# Altium schematic sheet LMV324AILQ对射-20260911.SchDoc
size 400 x 400 mm
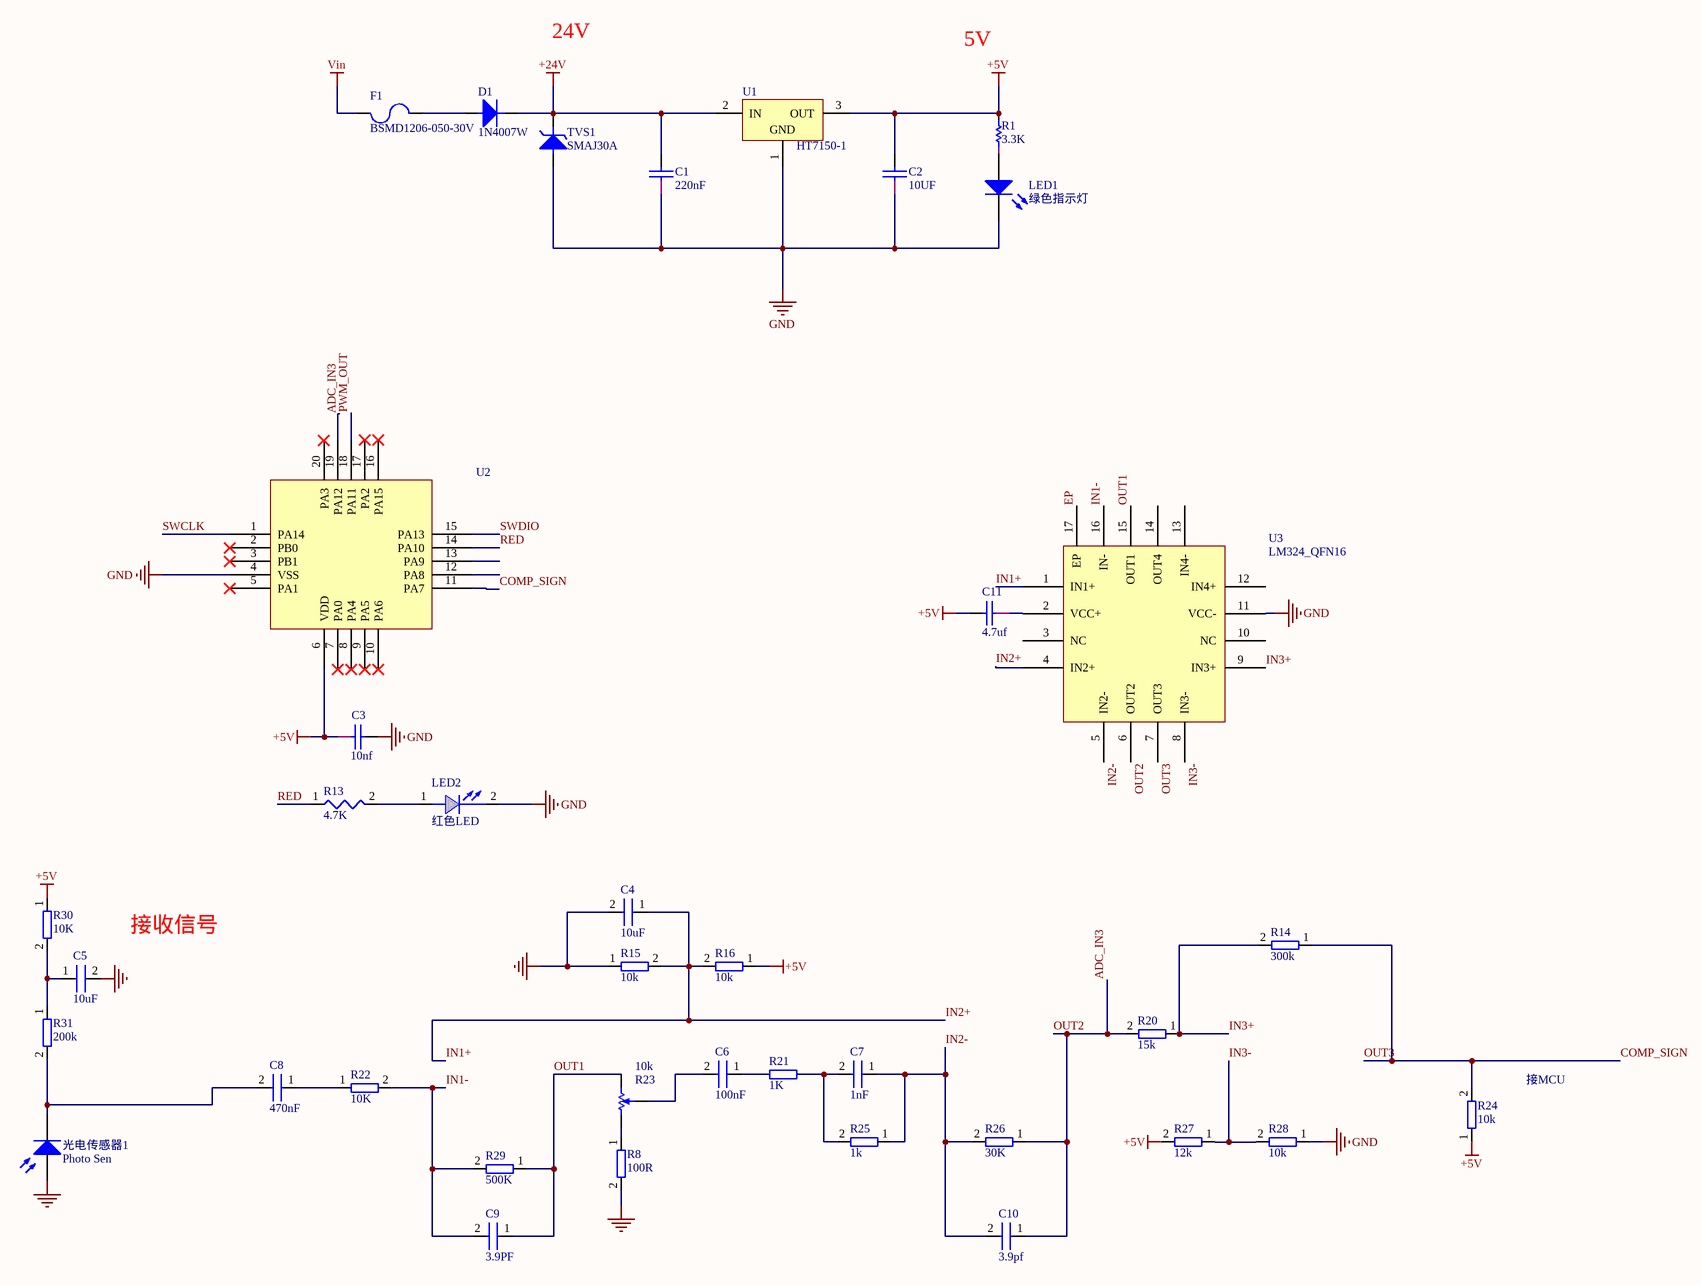
[diagram p0: LMV324AILQ对射-20260911.SchDoc]

## Parts
C1  220nF  [0603A]
C2  10UF  [0603A]
C3  10nf  [0603A]
C4  10uF
C5  10uF
C6  100nF
C7  1nF
C8  470nF
C9  3.9PF
C10  3.9pf
C11  4.7uf  [0603A]
D1  1N4007W  [D1]
F1  BSMD1206-050-30V  [1206]
LED1  绿色指示灯  [3.2X1.6X1.1]
LED2  红色LED  [0603V]
R1  3.3K  [0603]
R8  100R
R13  4.7K  [0402]
R14  300k
R15  10k
R16  10k
R20  15k
R21  1K
R22  10K
R23  10k  [POT4MM-2]
R24  10k
R25  1k
R26  30K
R27  12k
R28  10k
R29  500K
R30  10K
R31  200k
TVS1  SMAJ30A  [D2]
U1  HT7150-1  [SOT89N]
U2  (no value)  [HT3.96-11P]
U3  LM324_QFN16
光电传感器1  Photo Sen  [PIN2]

## Nets
+5V: C2.1 C3.2 C11.1 R1.1 R16.1 R24.1 R27.2 R30.1 U1.3(OUT) U2.6(VDD)
+24V: C1.1 D1.2(K) TVS1.2 U1.2(IN)
GND: C1.2 C2.2 C3.1 C4.2 C5.2 LED1.2(K) LED2.2(CATHODE) R8.2 R15.1 R28.1 TVS1.1 U1.1(GND) U2.4(VSS) U3.11(VCC-) 光电传感器1.1(A)
Vin: F1.2
ADC_IN3: C10.1 R20.2 R26.1 U2.19(PA12) U3.6(OUT2)  [also labelled OUT2]
COMP_SIGN: R14.1 R24.2 U2.11(PA7) U3.7(OUT3)  [also labelled OUT3]
EP: U3.17(EP)
IN1+: C4.1 R15.2 R16.2 U3.1(IN1+) U3.4(IN2+)  [also labelled IN2+]
IN1-: C9.2 R22.2 R29.2 U3.16(IN-)
IN2-: C7.1 C10.2 R25.1 R26.2 U3.5(IN2-)
IN3+: R14.2 R20.1 U3.9(IN3+)
IN3-: R27.1 R28.2 U3.8(IN3-)
OUT1: C9.1 R23.CW(+) R29.1 U3.15(OUT1)
PWM_OUT: U2.18(PA11)
RED: R13.1 U2.14(PA10)
SWCLK: U2.1(PA14)
SWDIO: U2.15(PA13)
NetC5_1: C5.1 R30.2 R31.1
NetC6_2: C6.2 R23.W
NetC7_2: C7.2 R25.2
NetC8_1: C8.1 R22.1
NetC8_2: C8.2 R31.2 光电传感器1.2(K)
NetC11_2: C11.2 U3.2(VCC+)
NetD1_1: D1.1(A) F1.1
NetLED1_1: LED1.1(A) R1.2
NetLED2_1: LED2.1(ANODE) R13.2
NetR8_1: R8.1 R23.CCW(-)

Not connected (* = marked no-connect by the designer): C6 1; R21 1 2; U2 2(PB0)* 3(PB1)* 5(PA1)* 7(PA0)* 8(PA4)* 9(PA5)* 10(PA6)* 12(PA8) 13(PA9) 16(PA15)* 17(PA2)* 20(PA3); U3 3(NC) 10(NC) 12(IN4+) 13(IN4-) 14(OUT4)

## Notes on the sheet
- 24V
- 5V
- 接收信号
- 接MCU

## Library data of the parts
C1 C2 C11 = CAP: Capacitor
C3 = CAP: 陶瓷电容
C4-C10 = CAP
D1 = DIODE
F1 = FUSE
LED1 = LED2: Typical RED, GREEN, YELLOW, AMBER GaAs LED; Published: 8-Jun-2000; LatestRevisionDate: 17-Jul-2002; LatestRevisionNote: Re-released for DXP Platform.; PackageVersion: Feb-2002; PackageReference: 3.2X1.6X1.1; Publisher: Altium Limited; PackageDescription: SM LED; 2 Flat Leads
LED2 = LED: Text Field1: 40; Text Field2: 20
R1 = RAS
R8 R14-R16 R20-R22 R24-R31 = RES
R13 = R: Text Field1: 20; Text Field2: 30
R23 = RPot SM: Square Trimming Potentiometer; Published: 17-Dec-2003; DatasheetVersion: Oct-2003; PackageReference: POT4MM-2; Publisher: Altium Limited; PackageDescription: Square Trimming Potentiometer; ComponentLink1Description: Manufacturer Link; ComponentLink1URL: http://bourns.com/2/search.html
TVS1 = DIODE V: Varactor Diode
U1 = HT7530-1: 3.0V 100mA Low Power,  Low Dropout Voltage (LDO) Regulator; Published: 30-Mar-2007; DatasheetVersion: rev1.50, Jan-2006; PackageVersion: Jan-2006; PackageReference: SOT-89; Publisher: Altium Limited; PackageDescription: 3-Pin SOT-89 Package 1.5 mm Pitch, 4.1 mm Lead Span; Code_IPC: SOT89; ComponentLink1Description: Manufacturer Link; ComponentLink1URL: http://www.holtek.com/; ComponentLink2Description: Datasheet; ComponentLink2URL: http://www.holtek.com/pdf/consumer/75xx_1v150.pdf
U2 = MG32F003-QFN20: QFN20主控芯片
光电传感器1 = Photo Sen: Photosensitive Diode; Published: 24-Mar-1999; LatestRevisionDate: 17-Jul-2002; LatestRevisionNote: Re-released for DXP Platform.; PackageReference: PIN2; Publisher: Altium Limited